# EAGLE design pc8500romriser (EAGLE 9.6.2)
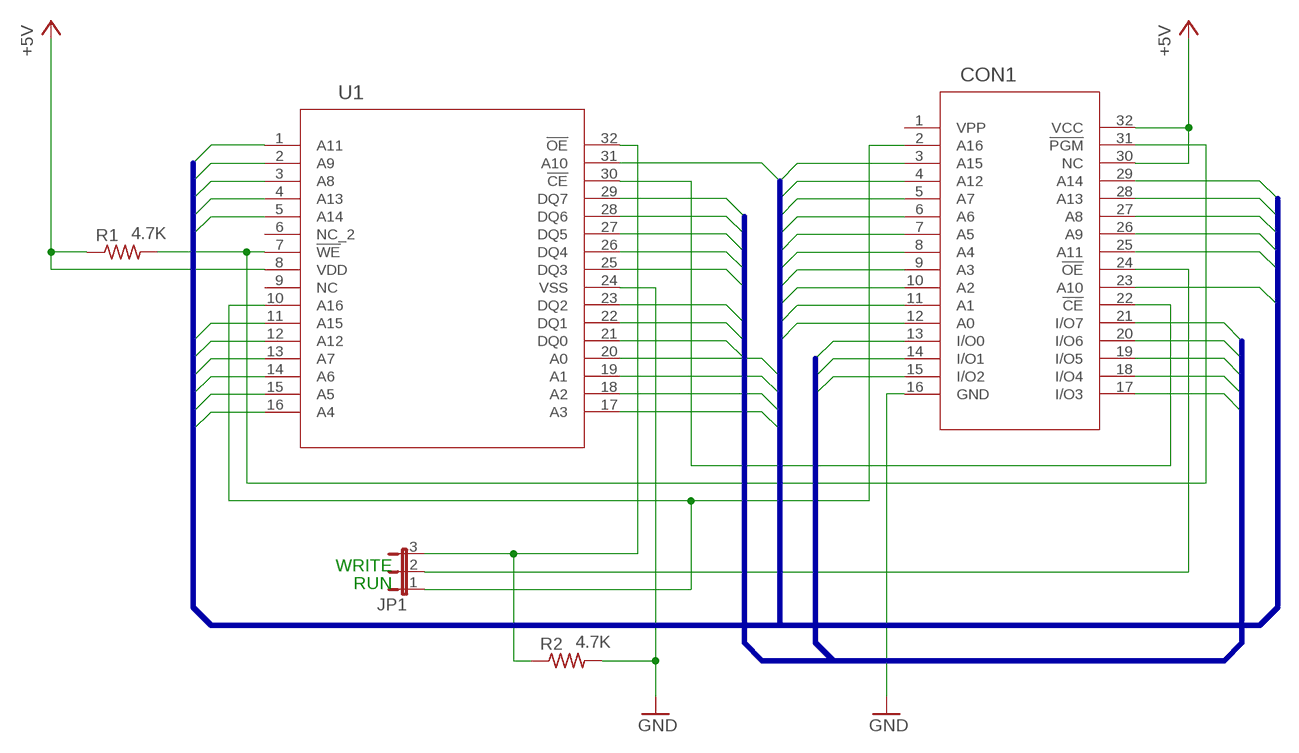
[diagram p0: schematic, sheet 1]

## Parts
CON1  HN27C101AG  [HN27C101AG]
JP1  JP2E  [JP2]
R1  4.7K  R-US_R2010  [R2010]
R2  4.7K  R-US_R2010  [R2010]
U1  SST39VF010-70-4I-WHETSOP32_WH_SST_MCH-M  [TSOP32_WH_SST_MCH-M]

## Nets
+5V: CON1.30(NC) CON1.32(VCC) R1.1 U1.8(VDD)
/CE: CON1.22(!CE) U1.30(!CE)
/OE: JP1.3 R2.1 U1.32(!OE)
/WE: CON1.31(!PGM) R1.2 U1.7(!WE)
A0: CON1.12(A0) U1.20(A0)
A1: CON1.11(A1) U1.19(A1)
A2: CON1.10(A2) U1.18(A2)
A3: CON1.9(A3) U1.17(A3)
A4: CON1.8(A4) U1.16(A4)
A5: CON1.7(A5) U1.15(A5)
A6: CON1.6(A6) U1.14(A6)
A7: CON1.5(A7) U1.13(A7)
A8: CON1.27(A8) U1.3(A8)
A9: CON1.26(A9) U1.2(A9)
A10: CON1.23(A10) U1.31(A10)
A11: CON1.25(A11) U1.1(A11)
A12: CON1.4(A12) U1.12(A12)
A13: CON1.28(A13) U1.4(A13)
A14: CON1.29(A14) U1.5(A14)
A15: CON1.3(A15) U1.11(A15)
A16: CON1.2(A16) JP1.1 U1.10(A16)
A16/OE: CON1.24(!OE) JP1.2
D0: CON1.13(I/O0) U1.21(DQ0)
D1: CON1.14(I/O1) U1.22(DQ1)
D2: CON1.15(I/O2) U1.23(DQ2)
D3: CON1.17(I/O3) U1.25(DQ3)
D4: CON1.18(I/O4) U1.26(DQ4)
D5: CON1.19(I/O5) U1.27(DQ5)
D6: CON1.20(I/O6) U1.28(DQ6)
D7: CON1.21(I/O7) U1.29(DQ7)
GND: CON1.16(GND) R2.2 U1.24(VSS)
Unconnected: U1.6(NC_2) U1.9(NC)

## Buses
A[0..15]
D[0..7]

## Notes on the sheet
- WRITE
- RUN

## Power pins joined to a net without a drawn wire
VPP: CON1.1(VPP)

## Library data of the parts
CON1 = Parts:HN27C101AG
JP1 = jumper:JP2E: JUMPER
R1 R2 = rcl:R-US_: RESISTOR, American symbol; SPICEPREFIX: R
U1 = Parts:SST39VF010-70-4I-WHE; COPYRIGHT: Copyright (C) 2021 Ultra Librarian. All rights reserved.; DIGI-KEY_PART_NUMBER_1: SST39VF010-70-4I-WHE-ND; MANUFACTURER_PART_NUMBER: SST39VF010-70-4I-WHE; MFR_NAME: Microchip

## Board
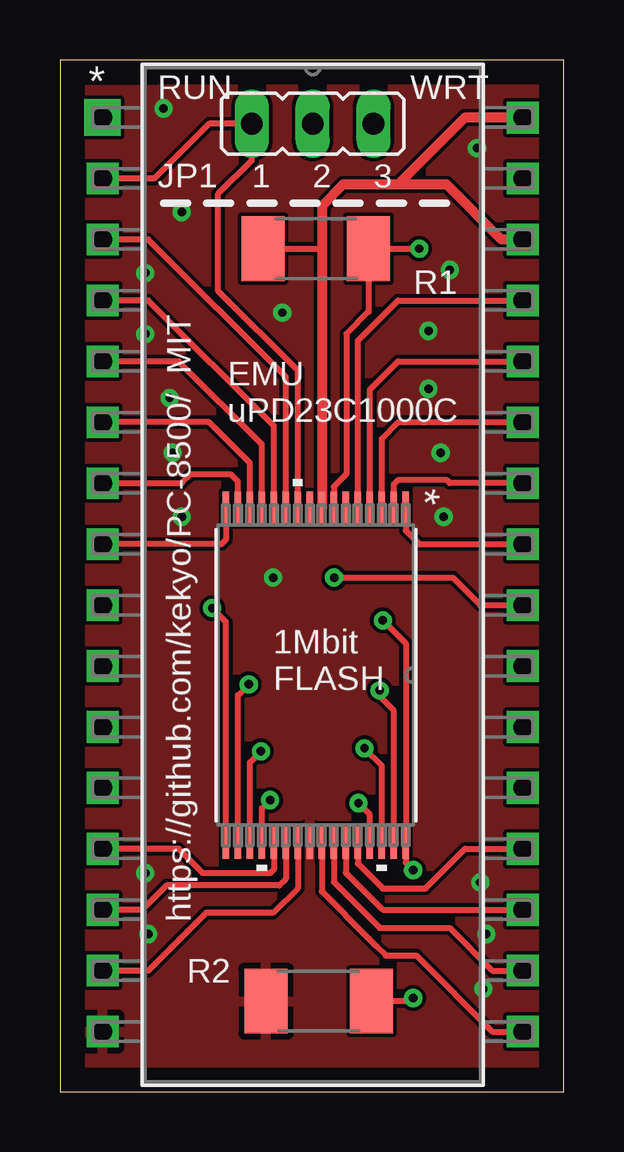
[diagram p1: board, top side]
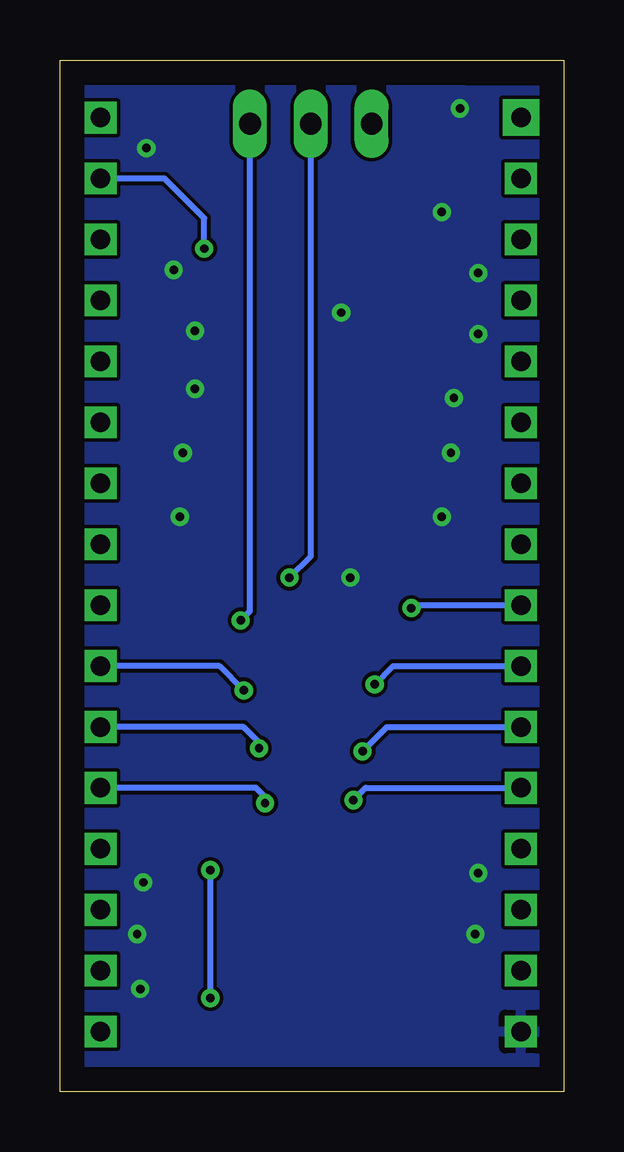
[diagram p2: board, bottom side, seen from below]

Size 21 x 43 mm. Coordinates in mm from the lower left corner, seen from the top.
Outline: 0,0 21,0 21,43 0,43 0,0
Copper layers (1*16): Top 0.035mm / dielectric 1.5mm / Bottom 0.035mm
Design rules "default": minimum track width 6mil, minimum drill 0.35mm, track to track 6mil, track to pad 6mil, pad to pad 6mil, via to via 6mil, smd to smd 6mil, copper to edge 40mil, drill to drill 6mil, minimum pad ring 10mil, minimum via ring 8mil, stop-mask expansion 4mil, vias tented up to drill 0mil, thermal gap 10mil

### Footprints (pad centres in the part's own frame; a part is rotated, then mirrored left to right if it is on the bottom)
HN27C101AG = drill 0.813 pad 1.524 square: 1 0,0 | drill 0.813 pad 0.813 square: 2 0,-2.54; 3 0,-5.08; 4 0,-7.62; 5 0,-10.16; 6 0,-12.7; 7 0,-15.24; 8 0,-17.78; 9 0,-20.32; 10 0,-22.86; 11 0,-25.4; 12 0,-27.94; 13 0,-30.48; 14 0,-33.02; 15 0,-35.56; 16 0,-38.1; 17 17.526,-38.1; 18 17.526,-35.56; 19 17.526,-33.02; 20 17.526,-30.48; 21 17.526,-27.94; 22 17.526,-25.4; 23 17.526,-22.86; 24 17.526,-20.32; 25 17.526,-17.78; 26 17.526,-15.24; 27 17.526,-12.7; 28 17.526,-10.16; 29 17.526,-7.62; 30 17.526,-5.08; 31 17.526,-2.54; 32 17.526,0
JP2 = drill 0.914 long: 1 -2.54,0; 2 0,0; 3 2.54,0
R2010 = smd 1.8 x 2.7: 1 -2.2,0; 2 2.2,0
TSOP32_WH_SST_MCH-M = smd 1.401 x 0.279: 1 -6.949,3.75; 2 -6.949,3.25; 3 -6.949,2.75; 4 -6.949,2.25; 5 -6.949,1.75; 6 -6.949,1.25; 7 -6.949,0.75; 8 -6.949,0.25; 9 -6.949,-0.25; 10 -6.949,-0.75; 11 -6.949,-1.25; 12 -6.949,-1.75; 13 -6.949,-2.25; 14 -6.949,-2.75; 15 -6.949,-3.25; 16 -6.949,-3.75; 17 6.949,-3.75; 18 6.949,-3.25; 19 6.949,-2.75; 20 6.949,-2.25; 21 6.949,-1.75; 22 6.949,-1.25; 23 6.949,-0.75; 24 6.949,-0.25; 25 6.949,0.25; 26 6.949,0.75; 27 6.949,1.25; 28 6.949,1.75; 29 6.949,2.25; 30 6.949,2.75; 31 6.949,3.25; 32 6.949,3.75

### Placement (x,y rotation side)
CON1  1.78,40.6 0 top
JP1  10.54,40.34 0 top
R1  10.67,35.14 0 top
R2  10.79,3.77 180 top
U1  10.67,17.36 270 top

### Tracks (layer width: path | path; a pad name or v marks a point on that pad's centre or on a via)
+5V
  Top 0.254: R1.1 10.92,35.14
  Top 0.406: 14.1,37.8 16.89,40.6 CON1.32 | 14.1,37.8 11.81,37.8 10.92,36.91 10.92,35.14 U1.8 | CON1.30 18.41,35.52 16.13,37.8 14.1,37.8
/CE  (via drill 0.35)
  Top 0.254: U1.30 13.42,13.59 v12.7,14.31
  Bottom 0.254: v12.7,14.31 12.7,14.56 13.34,15.2 CON1.22
/OE  (via drill 0.35)
  Top 0.254: v13.46,19.64 14.42,18.69 U1.32 14.42,9.54 v14.73,9.23 | v14.73,3.89 14.61,3.77 R2.1
  Bottom 0.254: v13.46,19.64 13.08,20.02 JP1.3 | v14.73,9.23 v14.73,3.89
/WE  (via drill 0.35)
  Top 0.254: v14.99,35.14 R1.2 12.87,32.51 11.94,31.58 11.94,25.74 11.42,25.22 U1.7
  Bottom 0.254: v14.99,35.14 14.99,36.41 16.64,38.06 CON1.31
A0  (via drill 0.35)
  Top 0.254: U1.20 8.42,11.8 v8.76,12.15
  Bottom 0.254: v8.76,12.15 8.26,12.66 CON1.12
A1  (via drill 0.35)
  Top 0.254: U1.19 7.92,13.72 v8.38,14.18
  Bottom 0.254: v8.38,14.18 7.37,15.2 CON1.11
A2  (via drill 0.35)
  Top 0.254: U1.18 7.42,16.52 v7.87,16.98
  Bottom 0.254: v7.87,16.98 7.11,17.74 CON1.10
A3  (via drill 0.35)
  Top 0.254: U1.17 6.92,19.58 v6.35,20.15
  Bottom 0.254: v6.35,20.15 6.22,20.28 CON1.9
A4
  Top 0.254: U1.16 6.92,23 6.73,22.82 CON1.8
A5
  Top 0.254: U1.15 7.42,25.43 7.37,25.48 7.11,25.74 5.46,25.74 5.08,25.36 CON1.7
A6
  Top 0.254: U1.14 7.92,26.2 6.22,27.9 CON1.6
A7
  Top 0.254: U1.13 8.42,26.97 4.95,30.44 CON1.5
A8
  Top 0.254: U1.3 13.42,27.22 14.1,27.9 CON1.27
A9
  Top 0.254: U1.2 13.92,25.3 14.1,25.48 16.13,25.48 16.26,25.36 CON1.26
A10  (via drill 0.35)
  Top 0.254: U1.31 13.92,15.88 13.34,16.47 v13.34,16.72
  Bottom 0.254: v13.34,16.72 14.35,17.74 CON1.23
A11
  Top 0.254: U1.1 14.42,23.38 14.99,22.82 CON1.25
A12
  Top 0.254: U1.12 8.92,27.74 3.68,32.98 CON1.4
A13
  Top 0.254: U1.4 12.92,29.26 14.1,30.44 CON1.28
A14
  Top 0.254: U1.5 12.42,31.3 14.1,32.98 CON1.29
A15
  Top 0.254: CON1.3 3.68,35.52 9.42,29.78 U1.11
A16
  Top 0.254: CON1.2 3.94,38.06 6.22,40.34 JP1.1 8,38.82 6.6,37.42 6.6,33.36 9.92,30.04 U1.10
A16/OE  (via drill 0.35)
  Top 0.254: v11.43,21.42 16.38,21.42 17.53,20.28 CON1.24
  Bottom 0.254: v11.43,21.42 10.54,22.31 JP1.2
D0
  Top 0.254: U1.21 8.92,9.26 8.76,9.1 5.97,9.1 4.95,10.12 CON1.13
D1
  Top 0.254: U1.22 9.42,8.87 9.14,8.59 4.45,8.59 3.43,7.58 CON1.14
D2
  Top 0.254: U1.23 9.92,8.48 8.89,7.45 6.1,7.45 3.68,5.04 CON1.15
D3
  Top 0.254: U1.25 10.92,8.34 12.89,6.37 13.21,6.05 13.59,5.67 14.86,5.67 18.03,2.5 CON1.17
D4
  Top 0.254: U1.26 11.42,8.73 11.94,8.21 13.34,6.81 16.26,6.81 18.03,5.04 CON1.18
D5
  Top 0.254: U1.27 11.92,9.12 13.46,7.58 CON1.19
D6
  Top 0.254: U1.28 12.42,9.51 13.46,8.47 15.24,8.47 16.89,10.12 CON1.20
D7  (via drill 0.35)
  Top 0.254: U1.29 12.92,11.55 v12.45,12.02
  Bottom 0.254: v12.45,12.02 12.45,12.28 12.83,12.66 CON1.21
GND  (via drill 0.35)
  Top 0.254: U1.24 10.42,9.99 10.41,9.99
  other vias: 5.08,23.96 8.89,21.42 17.4,39.33 16.26,34.25 9.27,32.47 5.08,36.66 3.56,31.58 15.37,31.71 15.37,29.29 15.88,26.63 16,23.96 4.57,28.91 4.7,26.63 3.56,34.12 4.32,40.98 17.53,8.72 17.78,6.56 3.56,9.1 3.68,6.56 17.65,4.27
  pour Bottom: 0.89,41.74 0.89,0.85 20.19,0.85 20.19,41.87
  pour Top: 0.89,41.74 0.89,0.85 20.19,0.85 20.19,41.87

### Text on the board
tNames: RUN | WRT | EMU / uPD23C1000C | 1Mbit / FLASH | https://github.com/kekyo/PC-8500/ MIT